# EAGLE design POVDisplayBase (EAGLE 7.4.0)
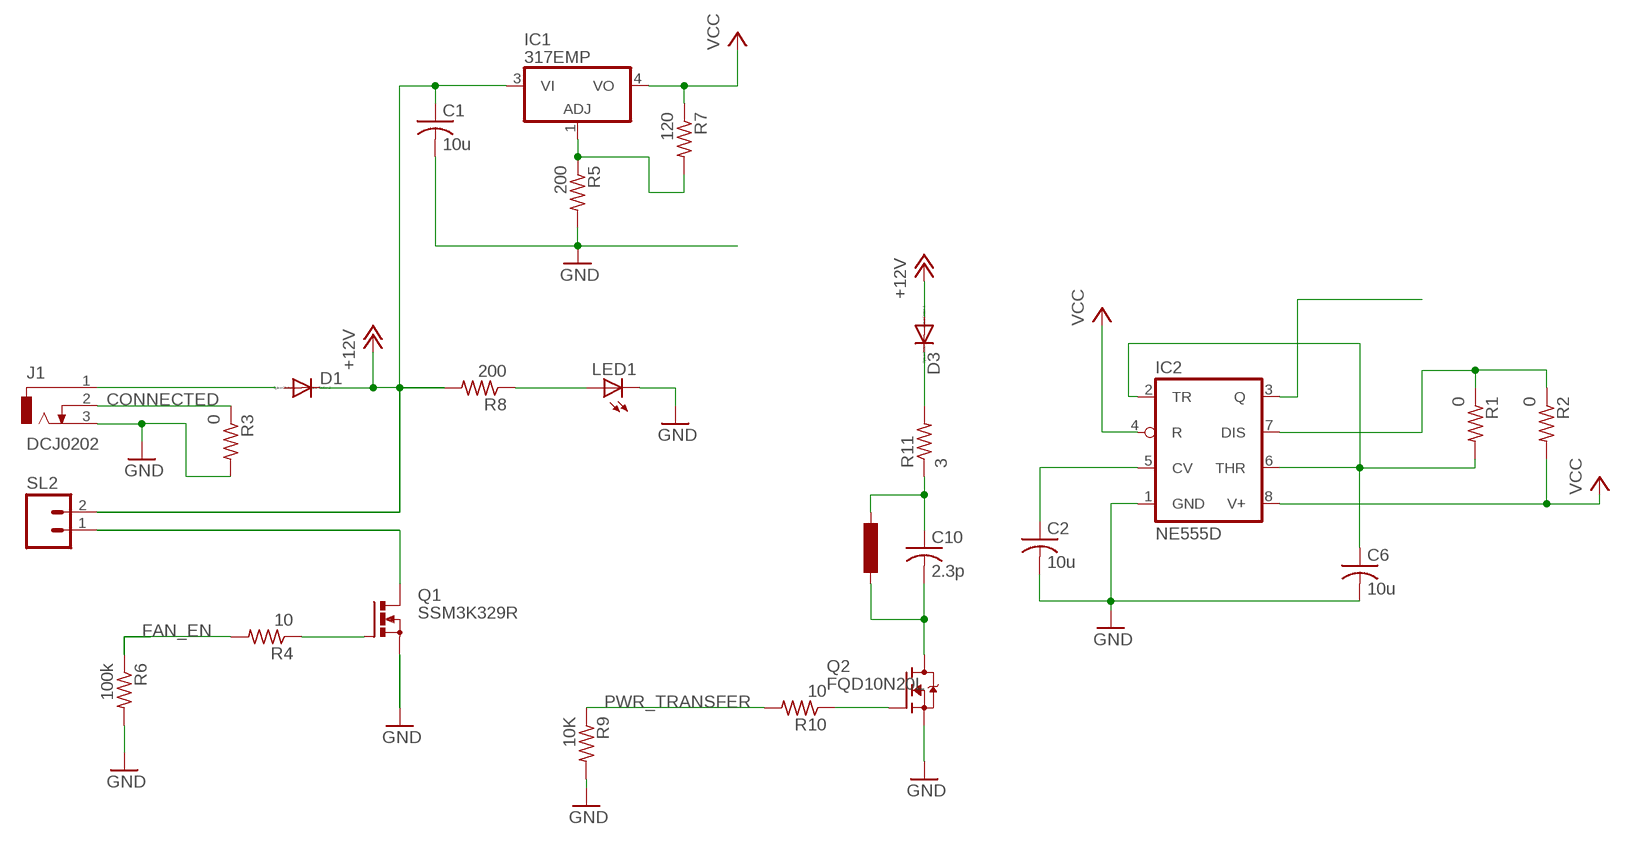
[diagram p0: schematic, sheet 1]

## Parts
C1  10u  C-USC0603  [C0603]
C2  10u  C-USC0603  [C0603]
C6  10u  C-USC0603  [C0603]
C10  2.3p  C-USC1210  [C1210]
D1  DIODE-DO-214AC  [DO-214AC]
D3  DIODE-SMC  [SMC]
IC1  317EMP  [SOT223]
IC2  NE555D  [SO08]
J1  DCJ0202  [DCJ0202]
LED1  LEDCHIPLED_1206  [CHIPLED_1206]
Q1  SSM3K329R  [SOT23]
Q2  FQD10N20L  [TO252]
R1  0  R-US_R0603  [R0603]
R2  0  R-US_R0603  [R0603]
R3  0  R-US_R0603  [R0603]
R4  10  R-US_R0603  [R0603]
R5  200  R-US_R0603  [R0603]
R6  100k  R-US_R0603  [R0603]
R7  120  R-US_R0603  [R0603]
R8  200  R-US_R0603  [R0603]
R9  10K  R-US_R0603  [R0603]
R10  10  R-US_R0603  [R0603]
R11  3  R-US_R1210  [R1210]
SL2  M02  [02P]

## Nets
+12V: C1.1 D1.C D3.A IC1.3(VI) R8.2 SL2.2
CONNECTED: J1.2 R3.1
FAN_EN: R4.2 R6.1
GND: C1.2 C2.2 C6.2 IC2.1(GND) J1.3 LED1.C Q1.2(S) Q2.2(S) R3.2 R5.2 R6.2 R9.2
N$1: Q2.1(G) R10.1
N$2: LED1.A R8.1
N$3: Q1.3(D) SL2.1
N$4: IC2.3(Q)
N$5: C6.1 IC2.2(TR) IC2.6(THR) R1.2
N$6: J1.1
N$7: IC1.1(ADJ) R5.1 R7.2
N$9: IC2.7(DIS) R1.1 R2.1
N$10: Q1.1(G) R4.1
N$12: D3.C R11.2
N$14: C2.1 IC2.5(CV)
NEG_COIL: C10.2 Q2.3(D)
POS_COIL: C10.1 R11.1
PWR_TRANSFER: R9.1 R10.2
VCC: IC1.4(VO) IC2.4(R) IC2.8(V+) R2.2 R7.1
Unconnected: D1.A

## Library data of the parts
C1 C2 C6 C10 = resistor:C-US: CAPACITOR, American symbol
D1 = diode:DIODE-: DIODE; DIGIKEY: 641-1707-1-ND
D3 = diode:DIODE-: DIODE; DIGIKEY: S5KC-FDICT-ND
IC1 = linear:*317: Positive VOLTAGE REGULATOR; DIGIKEY: 497-4241-1-ND
IC2 = linear:*555: TIMER
J1 = con-jack:DCJ0202: DC POWER JACK Source: DCJ0202.pdf; DIGIKEY: CP-002B-ND; MATING_CONN: CP3-1001-ND; OC_FARNELL: unknown; OC_NEWARK: unknown
LED1 = led:LED: LED OSRAM: - CHIPLED LG R971, LG N971, LY N971, LG Q971, LY Q971, LO R971, LY R971 LH N974, LH R974 LS Q976, LO Q976, LY Q976 LO Q996 - Hyper CHIPLED LW Q18S LB Q993, LB Q99A, LB R99A - SideLED LS A670, LO A670, LY A670, LG A670, LP A670 LB A673, LV A673, LT A673, LW A673 LH A674 LY A675 LS A676, LA A676, LO A676, LY A676, LW A676 LS A679, LY A679, LG A679 - Hyper Micro SIDELED® LS Y876, LA Y876, LO Y876, LY Y876 LT Y87S - SmartLED LW L88C, LW L88S LB L89C, LB L89S, LG L890 LS L89K, LO L89K, LY L89K LS L896, LA L896, LO L896, LY L896 - TOPLED LS T670, LO T670, LY T670, LG T670, LP T670 LSG T670, LSP T670, LSY T670, LOP T670, LYG T670 LG T671, LOG T671, LSG T671 LB T673, LV T673, LT T673, LW T673 LH T674 LS T676, LA T676, LO T676, LY T676, LB T676, LH T676, LSB T676, LW T676 LB T67C, LV T67C, LT T67C, LS T67K, LO T67K, LY T67K, LW E67C LS E67B, LA E67B, LO E67B, LY E67B, LB E67C, LV E67C, LT E67C LW T67C LS T679, LY T679, LG T679 LS T770, LO T770, LY T770, LG T770, LP T770 LB T773, LV T773, LT T773, LW T773 LH T774 LS E675, LA E675, LY E675, LS T675 LS T776, LA T776, LO T776, LY T776, LB T776 LHGB T686 LT T68C, LB T68C - Hyper Mini TOPLED® LB M676 - Mini TOPLED Santana® LG M470 LS M47K, LO M47K, LY M47K Source: http://www.osram.convergy.de LUXEON: - LUMILED® LXK2-PW12-R00, LXK2-PW12-S00, LXK2-PW14-U00, LXK2-PW14-V00 LXK2-PM12-R00, LXK2-PM12-S00, LXK2-PM14-U00 LXK2-PE12-Q00, LXK2-PE12-R00, LXK2-PE12-S00, LXK2-PE14-T00, LXK2-PE14-U00 LXK2-PB12-K00, LXK2-PB12-L00, LXK2-PB12-M00, LXK2-PB14-N00, LXK2-PB14-P00, LXK2-PB14-Q00 LXK2-PR12-L00, LXK2-PR12-M00, LXK2-PR14-Q00, LXK2-PR14-R00 LXK2-PD12-Q00, LXK2-PD12-R00, LXK2-PD12-S00 LXK2-PH12-R00, LXK2-PH12-S00 LXK2-PL12-P00, LXK2-PL12-Q00, LXK2-PL12-R00 Source: www.luxeon.com KINGBRIGHT: KA-3528ASYC Source: www.kingbright.com; DIGIKEY: 1080-1346-1-ND
Q1 = NicksParts:SSM3K329R
Q2 = NicksParts:FQD10N20L; DIGIKEY: FQD10N20LTMCT-ND
R1-R3 R8-R10 = resistor:R-US_: RESISTOR, American symbol; DIGIKEY: P180GCT-ND
R4 = resistor:R-US_: RESISTOR, American symbol; DIGIKEY: P100KGCT-ND
R5-R7 = resistor:R-US_: RESISTOR, American symbol; DIGIKEY: P0.0GCT-ND
R11 = resistor:R-US_: RESISTOR, American symbol
SL2 = con-amp-quick:M02: AMP QUICK CONNECTOR; OC_FARNELL: unknown; OC_NEWARK: unknown

## Board
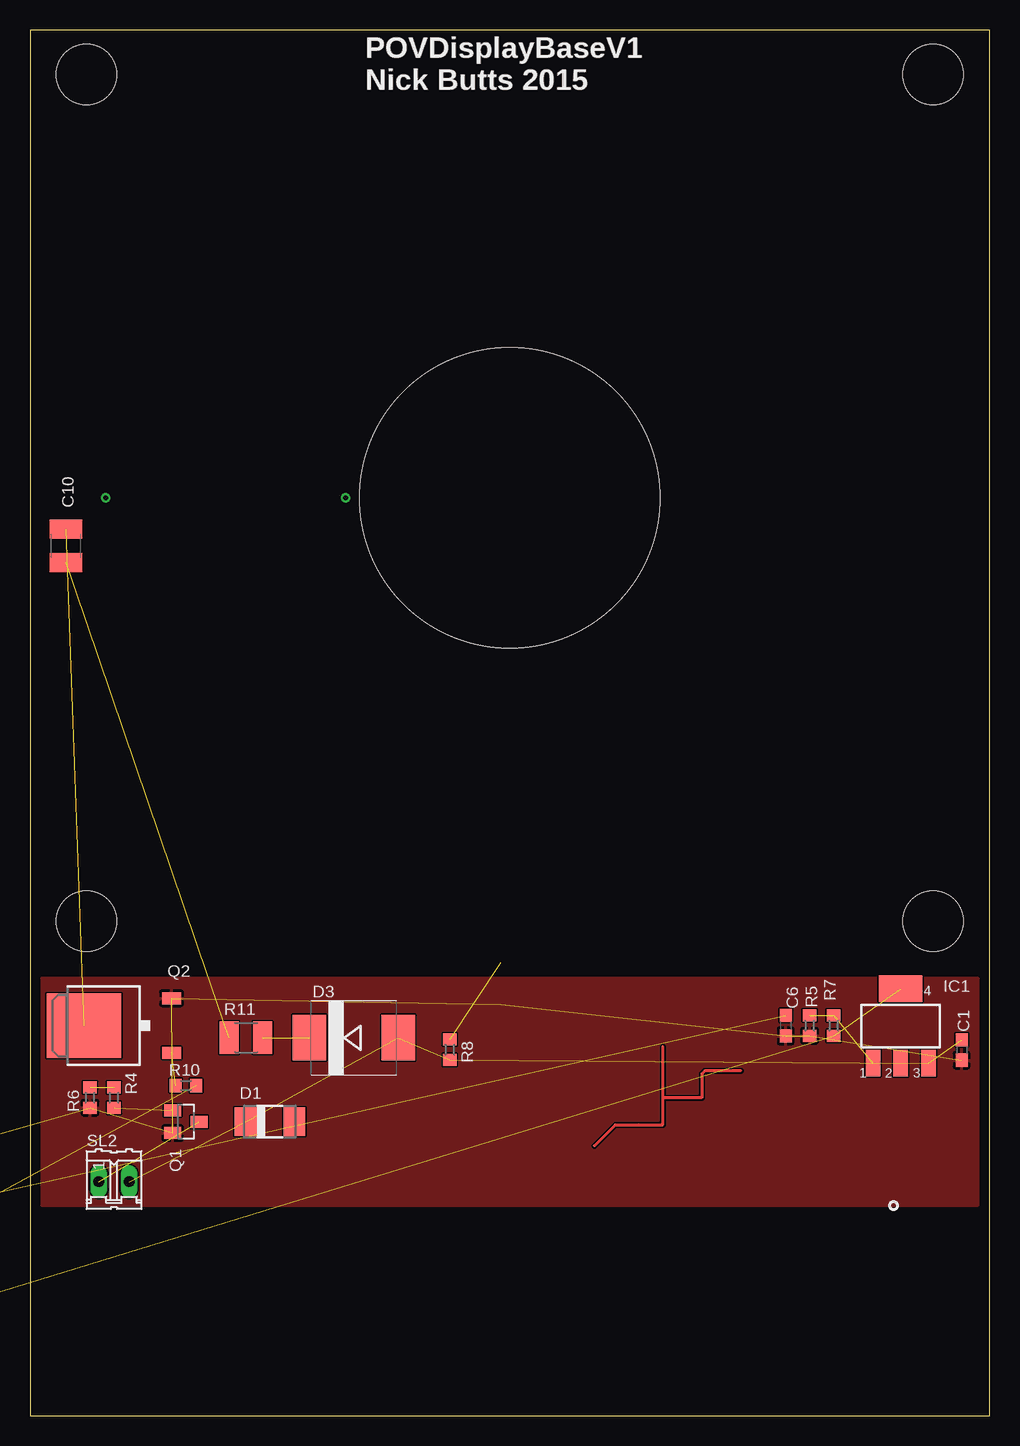
[diagram p1: board, top side]
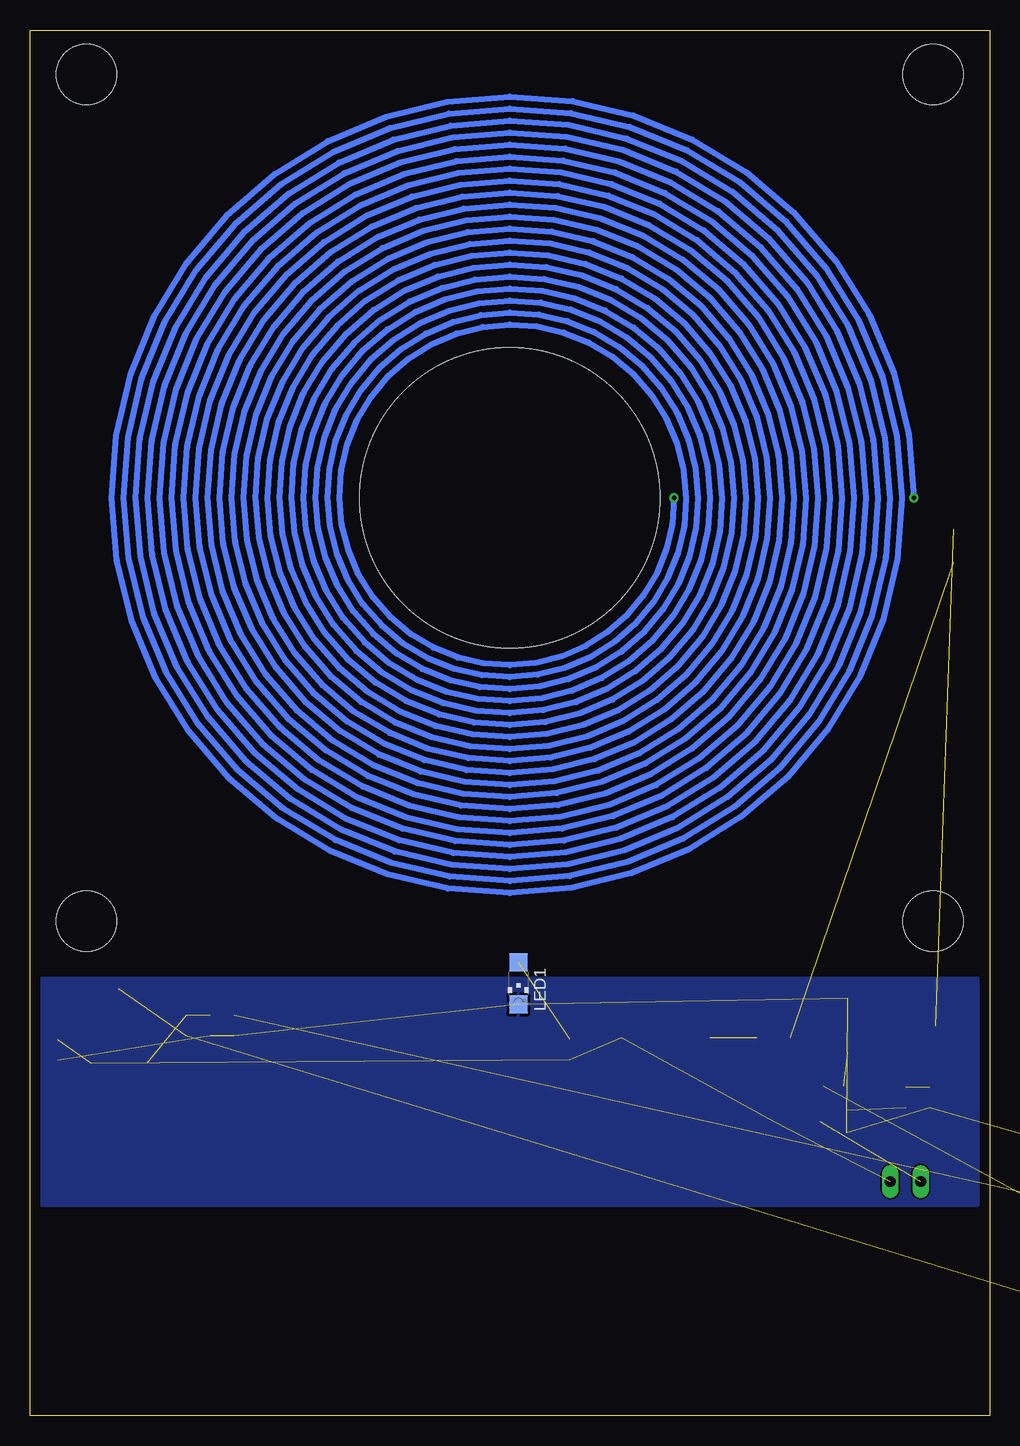
[diagram p2: board, bottom side, seen from below]

Size 80 x 115.51 mm. Coordinates in mm from the lower left corner, seen from the top.
Outline: 0,0 80,0 80,115.51 0,115.51 0,0
Copper layers (1*16): Top 0.0356mm / dielectric 1.5011mm / Bottom 0.0356mm
Design rules "LaenPCBOrder": minimum track width 6mil, minimum drill 13mil, track to track 6mil, track to pad 6mil, pad to pad 6mil, via to via 6mil, smd to smd 6mil, copper to edge 15mil, drill to drill 6mil, minimum pad ring 7mil, minimum via ring 7mil, stop-mask expansion 3mil, vias tented up to drill 0mil, thermal gap 10mil
Holes 25 mm at 40,76.51
Holes 5 mm at 4.7,111.81 75.3,111.81 4.7,41.21 75.3,41.21

### Footprints (pad centres in the part's own frame; a part is rotated, then mirrored left to right if it is on the bottom)
C0603 = smd 1.1 x 1: 1 -0.85,0; 2 0.85,0
C1210 = smd 1.6 x 2.7: 1 -1.4,0; 2 1.4,0
DO-214AC = smd 1.8 x 2.4: A 2.025,0; C -2.025,0
SMC = smd 2.8 x 3.8: A 3.7,0; C -3.7,0
SOT223 = smd 1.219 x 2.235: 1 -2.311,-3.099; 2 0,-3.099; 3 2.311,-3.099 | smd 3.6 x 2.2: 4 0,3.099
SO08 = smd 0.6 x 2.2: 1 -1.905,-2.6; 2 -0.635,-2.6; 3 0.635,-2.6; 4 1.905,-2.6; 5 1.905,2.6; 6 0.635,2.6; 7 -0.635,2.6; 8 -1.905,2.6
DCJ0202 = drill 1 pad 2 long: 1 0,3.1; 2 4.8,0; 3 0,-3
CHIPLED_1206 = smd 1.5 x 1.5: A 0,-1.75; C 0,1.75
SOT23 = smd 1 x 1.4: 1 -0.95,-1.1; 2 0.95,-1.1; 3 0,1.1
TO252 = smd 1 x 1.6: 1 -2.28,-4.8; 2 2.28,-4.8 | smd 5.4 x 6.2: 3 0,2.5
R0603 = smd 1 x 1.1: 1 -0.85,0; 2 0.85,0
R1210 = smd 1.6 x 2.7: 1 -1.4,0; 2 1.4,0
02P = drill 0.914 long: 1 -1.27,0; 2 1.27,0

### Placement (x,y rotation side)
C1  77.67,30.48 270 top
C2  -47,-11.49 0 top  (outside the outline)
C6  63,32.51 270 top
C10  3,72.51 90 top
D1  20,24.51 0 top
D3  27,31.51 0 top
IC1  72.59,32.48 0 top
IC2  -45,0.51 0 top  (outside the outline)
J1  -33.02,17.78 0 top  (outside the outline)
LED1  39.28,36.03 180 bottom
Q1  13,24.51 270 top
Q2  7,32.51 90 top
R1  -24.13,13.97 0 top  (outside the outline)
R2  -47,-6.49 0 top  (outside the outline)
R3  -38.1,3.81 0 top  (outside the outline)
R4  7,26.51 90 top
R5  65,32.51 270 top
R6  5,26.51 270 top
R7  67,32.51 90 top
R8  35,30.51 270 top
R9  -38.1,-1.27 0 top  (outside the outline)
R10  13,27.51 0 top
R11  18,31.51 0 top
SL2  7,19.51 0 top

### Tracks (layer width: path | path; a pad name or v marks a point on that pad's centre or on a via)
+12V  (5 unrouted)
CONNECTED  (1 unrouted)
FAN_EN  (1 unrouted)
GND  (11 unrouted)
  pour Top: 1,36.51 79,36.51 79,17.51 1,17.51
  pour Bottom: 79,36.51 1,36.51 1,17.51 79,17.51
N$1  (1 unrouted)
N$2  (1 unrouted)
N$3  (1 unrouted)
N$5  (3 unrouted)
N$7  (2 unrouted)
N$8  (via drill 0.4 pad 0.5)
  Bottom 0.5: v26.3,76.51 26.44,74.36 26.92,72.26 27.73,70.26 28.84,68.4 30.22,66.73 31.86,65.31 33.7,64.15 35.7,63.29 37.82,62.76 40,62.56 42.19,62.71 44.33,63.2 46.37,64.01 48.26,65.14 49.95,66.56 51.41,68.22 52.59,70.1 53.46,72.14 54,74.29 54.2,76.51 54.05,78.73 53.55,80.91 52.72,82.99 51.57,84.92 50.13,86.64 48.44,88.12 46.53,89.32 44.45,90.2 42.26,90.76 40,90.96 37.74,90.81 35.52,90.3 33.41,89.45 31.45,88.28 29.69,86.82 28.19,85.09 26.97,83.15 26.07,81.04 25.51,78.81 25.3,76.51 25.46,74.21 25.97,71.95 26.84,69.8 28.03,67.81 29.52,66.03 31.27,64.5 33.25,63.26 35.4,62.34 37.66,61.77 40,61.56 42.34,61.72 44.63,62.24 46.82,63.12 48.85,64.33 50.66,65.85 52.22,67.63 53.48,69.64 54.41,71.83 54.99,74.14 55.2,76.51 55.04,78.89 54.5,81.22 53.61,83.45 52.38,85.5 50.84,87.35 49.02,88.93 46.98,90.21 44.76,91.16 42.41,91.75 40,91.96 37.58,91.79 35.21,91.25 32.95,90.34 30.86,89.09 28.99,87.52 27.38,85.68 26.08,83.6 25.12,81.35 24.52,78.96 24.3,76.51 24.47,74.05 25.02,71.64 25.94,69.35 27.22,67.22 28.81,65.32 30.68,63.69 32.79,62.36 35.09,61.39 37.51,60.78 40,60.56 42.5,60.73 44.94,61.29 47.27,62.23 49.43,63.53 51.37,65.14 53.02,67.05 54.37,69.19 55.36,71.52 55.98,73.98 56.2,76.51 56.02,79.05 55.45,81.53 54.5,83.9 53.19,86.09 51.54,88.05 49.61,89.74 47.43,91.1 45.07,92.11 42.57,92.73 40,92.96 37.42,92.78 34.9,92.2 32.5,91.23 30.27,89.9 28.28,88.23 26.57,86.27 25.19,84.06 24.16,81.66 23.53,79.12 23.3,76.51 23.48,73.89 24.07,71.33 25.05,68.89 26.41,66.64 28.1,64.61 30.1,62.88 32.34,61.47 34.78,60.44 37.35,59.79 40,59.56 42.66,59.74 45.25,60.34 47.73,61.34 50.02,62.72 52.07,64.44 53.83,66.46 55.26,68.73 56.31,71.21 56.96,73.82 57.2,76.51 57.01,79.2 56.41,81.84 55.39,84.35 54,86.68 52.25,88.76 50.2,90.55 47.89,91.99 45.38,93.06 42.73,93.72 40,93.96 37.27,93.77 34.59,93.15 32.04,92.12 29.68,90.71 27.57,88.94 25.76,86.86 24.3,84.51 23.21,81.96 22.54,79.28 22.3,76.51 22.49,73.74 23.12,71.03 24.16,68.44 25.6,66.05 27.4,63.91 29.51,62.07 31.89,60.58 34.47,59.49 37.2,58.81 40,58.56 42.81,58.76 45.56,59.39 48.18,60.45 50.61,61.91 52.78,63.73 54.64,65.87 56.15,68.28 57.26,70.9 57.95,73.67 58.2,76.51 58,79.36 57.36,82.15 56.28,84.81 54.8,87.27 52.96,89.47 50.79,91.36 48.34,92.88 45.69,94.01 42.88,94.71 40,94.96 37.11,94.76 34.28,94.1 31.59,93.02 29.1,91.52 26.87,89.65 24.95,87.44 23.41,84.97 22.26,82.27 21.55,79.43 21.3,76.51 21.51,73.58 22.17,70.72 23.27,67.99 24.79,65.46 26.69,63.2 28.92,61.26 31.43,59.69 34.16,58.53 37.04,57.82 40,57.56 42.97,57.77 45.87,58.44 48.64,59.56 51.2,61.1 53.49,63.02 55.45,65.28 57.04,67.83 58.21,70.59 58.94,73.51 59.2,76.51 58.99,79.52 58.31,82.46 57.17,85.26 55.61,87.85 53.66,90.18 51.37,92.16 48.8,93.77 45.99,94.96 43.04,95.7 40,95.96 36.95,95.75 33.97,95.06 31.14,93.91 28.51,92.33 26.16,90.35 24.14,88.03 22.51,85.42 21.31,82.58 20.57,79.59 20.3,76.51 20.52,73.42 21.22,70.41 22.38,67.53 23.98,64.87 25.98,62.49 28.33,60.45 30.98,58.8 33.85,57.58 36.88,56.83 40,56.56 43.12,56.78 46.18,57.49 49.09,58.67 51.78,60.29 54.2,62.31 56.26,64.7 57.93,67.37 59.16,70.28 59.93,73.35 60.2,76.51 59.98,79.67 59.26,82.77 58.06,85.72 56.42,88.44 54.37,90.88 51.96,92.97 49.25,94.66 46.3,95.91 43.2,96.68 40,96.96 36.8,96.73 33.66,96.01 30.68,94.8 27.92,93.14 25.45,91.06 23.33,88.62 21.62,85.87 20.36,82.89 19.58,79.74 19.3,76.51 19.53,73.27 20.27,70.1 21.49,67.08 23.17,64.28 25.27,61.78 27.75,59.64 30.52,57.91 33.54,56.63 36.73,55.84 40,55.56 43.28,55.79 46.49,56.54 49.55,57.78 52.37,59.48 54.9,61.61 57.07,64.11 58.82,66.92 60.12,69.97 60.91,73.2 61.2,76.51 60.96,79.83 60.21,83.08 58.96,86.17 57.23,89.03 55.08,91.59 52.55,93.78 49.7,95.56 46.61,96.86 43.35,97.67 40,97.96 36.64,97.72 33.36,96.96 30.23,95.69 27.33,93.94 24.74,91.77 22.52,89.21 20.73,86.33 19.41,83.2 18.59,79.9 18.3,76.51 18.54,73.11 19.31,69.79 20.6,66.62 22.36,63.7 24.57,61.08 27.16,58.83 30.07,57.02 33.23,55.68 36.57,54.86 40,54.56 43.44,54.81 46.8,55.59 50,56.89 52.96,58.67 55.61,60.9 57.88,63.52 59.71,66.47 61.07,69.67 61.9,73.04 62.2,76.51 61.95,79.99 61.16,83.39 59.85,86.62 58.04,89.62 55.79,92.3 53.14,94.59 50.16,96.45 46.92,97.81 43.51,98.66 40,98.96 36.48,98.71 33.05,97.91 29.77,96.58 26.75,94.75 24.04,92.47 21.72,89.79 19.84,86.78 18.46,83.51 17.6,80.06 17.3,76.51 17.55,72.95 18.36,69.48 19.71,66.17 21.55,63.11 23.86,60.37 26.57,58.02 29.61,56.13 32.92,54.73 36.41,53.87 40,53.56 43.59,53.82 47.11,54.64 50.45,56 53.55,57.86 56.32,60.19 58.69,62.93 60.6,66.01 62.02,69.36 62.89,72.89 63.2,76.51 62.94,80.14 62.11,83.7 60.74,87.08 58.85,90.2 56.49,93 53.73,95.4 50.61,97.34 47.23,98.77 43.66,99.65 40,99.96 36.33,99.7 32.74,98.86 29.32,97.47 26.16,95.56 23.33,93.18 20.91,90.38 18.95,87.23 17.51,83.82 16.62,80.21 16.3,76.51 16.57,72.8 17.41,69.17 18.82,65.72 20.75,62.52 23.15,59.66 25.98,57.22 29.16,55.24 32.61,53.78 36.26,52.88 40,52.56 43.75,52.83 47.42,53.69 50.91,55.1 54.14,57.05 57.02,59.49 59.5,62.34 61.49,65.56 62.97,69.05 63.88,72.73 64.2,76.51 63.93,80.3 63.06,84 61.63,87.53 59.66,90.79 57.2,93.71 54.31,96.21 51.07,98.23 47.54,99.72 43.82,100.63 40,100.96 36.17,100.68 32.43,99.81 28.87,98.36 25.57,96.37 22.62,93.89 20.1,90.97 18.06,87.69 16.56,84.13 15.63,80.37 15.3,76.51 15.58,72.64 16.46,68.86 17.93,65.26 19.94,61.93 22.45,58.96 25.39,56.41 28.71,54.35 32.31,52.83 36.1,51.89 40,51.56 43.91,51.84 47.73,52.73 51.36,54.21 54.72,56.24 57.73,58.78 60.31,61.76 62.39,65.1 63.92,68.74 64.86,72.57 65.2,76.51 64.91,80.46 64.01,84.31 62.52,87.98 60.47,91.38 57.91,94.42 54.9,97.02 51.52,99.12 47.85,100.67 43.98,101.62 40,101.96 36.02,101.67 32.12,100.76 28.41,99.25 24.98,97.18 21.92,94.59 19.29,91.56 17.17,88.14 15.61,84.44 14.64,80.53 14.3,76.51 14.59,72.49 15.51,68.55 17.03,64.81 19.13,61.34 21.74,58.25 24.81,55.6 28.25,53.45 32,51.88 35.94,50.9 40,50.56 44.06,50.86 48.03,51.78 51.81,53.32 55.31,55.44 58.44,58.07 61.12,61.17 63.28,64.65 64.87,68.43 65.85,72.42 66.2,76.51 65.9,80.61 64.97,84.62 63.41,88.44 61.28,91.97 58.62,95.12 55.49,97.83 51.97,100.01 48.16,101.62 44.13,102.61 40,102.96 35.86,102.66 31.81,101.71 27.96,100.14 24.39,97.99 21.21,95.3 18.48,92.15 16.28,88.6 14.65,84.75 13.65,80.68 13.3,76.51 13.6,72.33 14.56,68.24 16.14,64.35 18.32,60.76 21.03,57.54 24.22,54.79 27.8,52.56 31.69,50.93 35.79,49.92 40,49.56 44.22,49.87 48.34,50.83 52.27,52.43 55.9,54.63 59.15,57.36 61.92,60.58 64.17,64.2 65.82,68.12 66.84,72.26 67.2,76.51 66.89,80.77 65.92,84.93 64.3,88.89 62.09,92.56 59.32,95.83 56.08,98.64 52.43,100.9 48.47,102.57 44.29,103.6 40,103.96 35.7,103.65 31.5,102.66 27.5,101.04 23.81,98.8 20.5,96.01 17.67,92.73 15.39,89.05 13.7,85.05 12.67,80.84 12.3,76.51 12.62,72.17 13.61,67.94 15.25,63.9 17.51,60.17 20.32,56.84 23.63,53.98 27.34,51.67 31.38,49.98 35.63,48.93 40,48.56 44.38,48.88 48.65,49.88 52.72,51.54 56.49,53.82 59.85,56.66 62.73,59.99 65.06,63.74 66.77,67.81 67.83,72.1 68.2,76.51 67.88,80.93 66.87,85.24 65.19,89.35 62.9,93.14 60.03,96.54 56.66,99.45 52.88,101.79 48.78,103.52 44.45,104.59 40,104.96 35.55,104.63 31.19,103.62 27.05,101.93 23.22,99.61 19.79,96.72 16.86,93.32 14.49,89.51 12.75,85.36 11.68,81 11.3,76.51 11.63,72.02 12.66,67.63 14.36,63.45 16.7,59.58 19.62,56.13 23.04,53.17 26.89,50.78 31.07,49.02 35.48,47.94 40,47.56 44.53,47.89 48.96,48.93 53.18,50.65 57.08,53.01 60.56,55.95 63.54,59.41 65.95,63.29 67.72,67.5 68.82,71.95 69.2,76.51 68.86,81.08 67.82,85.55 66.08,89.8 63.7,93.73 60.74,97.25 57.25,100.26 53.34,102.68 49.09,104.47 44.6,105.57 40,105.96 35.39,105.62 30.88,104.57 26.6,102.82 22.63,100.42 19.09,97.42 16.05,93.91 13.6,89.96 11.8,85.67 10.69,81.15 10.3,76.51 10.64,71.86 11.71,67.32 13.47,62.99 15.89,58.99 18.91,55.42 22.45,52.36 26.44,49.89 30.76,48.07 35.32,46.95 40,46.56 44.69,46.9 49.27,47.98 53.63,49.76 57.66,52.2 61.27,55.24 64.35,58.82 66.84,62.83 68.67,67.19 69.8,71.79 70.2,76.51 69.85,81.24 68.77,85.86 66.97,90.26 64.51,94.32 61.44,97.95 57.84,101.06 53.79,103.57 49.39,105.42 44.76,106.56 40,106.96 35.23,106.61 30.57,105.52 26.14,103.71 22.04,101.23 18.38,98.13 15.24,94.5 12.71,90.41 10.85,85.98 9.7,81.31 9.3,76.51 9.65,71.7 10.76,67.01 12.58,62.54 15.08,58.41 18.2,54.71 21.87,51.55 25.98,49 30.45,47.12 35.16,45.97 40,45.56 44.85,45.92 49.58,47.03 54.09,48.87 58.25,51.39 61.97,54.54 65.16,58.23 67.73,62.38 69.62,66.88 70.79,71.63 71.2,76.51 70.84,81.4 69.72,86.17 67.87,90.71 65.32,94.91 62.15,98.66 58.43,101.87 54.24,104.47 49.7,106.37 44.92,107.55 40,107.96 35.08,107.6 30.27,106.47 25.69,104.6 21.45,102.04 17.67,98.84 14.44,95.08 11.82,90.87 9.9,86.29 8.71,81.47 8.3,76.51 8.67,71.55 9.8,66.7 11.69,62.09 14.27,57.82 17.5,54.01 21.28,50.74 25.53,48.11 30.14,46.17 35.01,44.98 40,44.56 45,44.93 49.89,46.08 54.54,47.98 58.84,50.58 62.68,53.83 65.97,57.64 68.62,61.93 70.58,66.58 71.78,71.48 72.2,76.51 71.83,81.55 70.67,86.48 68.76,91.16 66.13,95.5 62.86,99.37 59.02,102.68 54.7,105.36 50.01,107.32 45.07,108.54 40,108.96 34.92,108.59 29.96,107.42 25.23,105.49 20.87,102.84 16.97,99.54 13.63,95.67 10.93,91.32 8.95,86.6 7.73,81.62 7.3,76.51 7.68,71.39 8.85,66.39 10.8,61.63 13.46,57.23 16.79,53.3 20.69,49.93 25.07,47.22 29.83,45.22 34.85,43.99 40,43.56 45.16,43.94 50.2,45.12 54.99,47.09 59.43,49.77 63.39,53.12 66.78,57.05 69.52,61.47 71.53,66.27 72.77,71.32 73.2,76.51 72.82,81.71 71.62,86.79 69.65,91.62 66.94,96.08 63.56,100.07 59.6,103.49 55.15,106.25 50.32,108.28 45.23,109.52 40,109.96 34.76,109.57 29.65,108.37 24.78,106.38 20.28,103.65 16.26,100.25 12.82,96.26 10.04,91.78 8,86.91 6.74,81.78 v6.3,76.51
N$9  (2 unrouted)
N$10  (1 unrouted)
N$12  (1 unrouted)
N$14  (1 unrouted)
NEG_COIL  (1 unrouted)
POS_COIL  (1 unrouted)
PWR_TRANSFER  (1 unrouted)
VCC  (4 unrouted)
VSS
  Top 0.254: 47.05,22.51 48.8,24.26 50.75,24.26 52.75,24.26 52.75,26.51 | 52.75,26.51 52.75,30.76 | 59.25,28.76 56.25,28.76 56,28.51 56,26.51 52.75,26.51

### Text on the board
tNames: POVDisplayBaseV1 / Nick Butts 2015